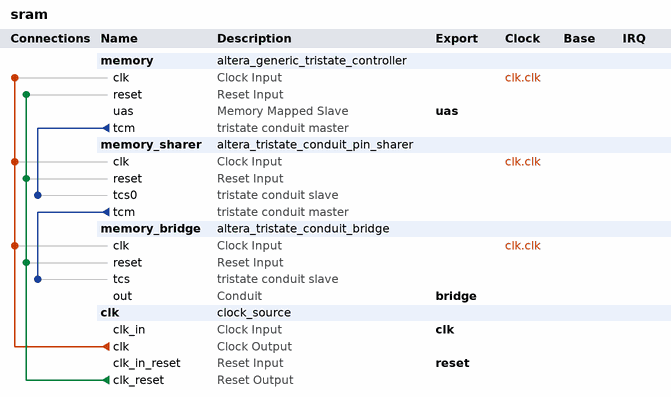
[diagram p0: system contents]
# Platform Designer (Qsys) system sram, Cyclone V 5CGXFC5C6F27C7
# Parameters at their usual value, and those the tool derives, are not listed.
package require -exact qsys 15.1
create_system sram
set_project_property DEVICE_FAMILY {Cyclone V}
set_project_property DEVICE 5CGXFC5C6F27C7

add_instance memory altera_generic_tristate_controller 15.1
set_instance_parameter_value memory ACTIVE_LOW_BEGINTRANSFER 0
set_instance_parameter_value memory ACTIVE_LOW_BYTEENABLE 1
set_instance_parameter_value memory ACTIVE_LOW_OUTPUTENABLE 1
set_instance_parameter_value memory ACTIVE_LOW_READ 0
set_instance_parameter_value memory CHIPSELECT_THROUGH_READLATENCY 0
set_instance_parameter_value memory INTERFACE_ASSIGNMENT_KEYS embeddedsw.configuration.isMemoryDevice
set_instance_parameter_value memory INTERFACE_ASSIGNMENT_VALUES 1
set_instance_parameter_value memory MODULE_ASSIGNMENT_KEYS embeddedsw.configuration.hwClassnameDriverSupportList,embeddedsw.CMacro.SRAM_MEMORY_SIZE,embeddedsw.CMacro.SRAM_MEMORY_UNITS,embeddedsw.CMacro.SSRAM_DATA_WIDTH,embeddedsw.memoryInfo.MEM_INIT_DATA_WIDTH,embeddedsw.memoryInfo.HAS_BYTE_LANE,embeddedsw.memoryInfo.GENERATE_DAT_SYM,embeddedsw.memoryInfo.DAT_SYM_INSTALL_DIR
set_instance_parameter_value memory MODULE_ASSIGNMENT_VALUES altera_avalon_lan91c111:altera_avalon_cfi_flash,524288,1,16,16,1,1,SIM_DIR
set_instance_parameter_value memory TCM_ADDRESS_W 19
set_instance_parameter_value memory TCM_BYTEENABLE_W 2
set_instance_parameter_value memory TCM_DATA_HOLD 10
set_instance_parameter_value memory TCM_DATA_W 16
set_instance_parameter_value memory TCM_MAX_PENDING_READ_TRANSACTIONS 3
set_instance_parameter_value memory TCM_READLATENCY 2
set_instance_parameter_value memory TCM_READ_WAIT 10
set_instance_parameter_value memory TCM_SETUP_WAIT 10
set_instance_parameter_value memory TCM_SYMBOLS_PER_WORD 2
set_instance_parameter_value memory TCM_TIMING_UNITS 0
set_instance_parameter_value memory TCM_TURNAROUND_TIME 2
set_instance_parameter_value memory TCM_WRITE_WAIT 10
set_instance_parameter_value memory USE_BEGINTRANSFER 0
set_instance_parameter_value memory USE_BYTEENABLE 1
set_instance_parameter_value memory USE_OUTPUTENABLE 1
set_instance_parameter_value memory USE_READ 0

add_instance memory_sharer altera_tristate_conduit_pin_sharer 15.1
set_instance_parameter_value memory_sharer MODULE_ORIGIN_LIST memory.tcm,memory.tcm,memory.tcm,memory.tcm,memory.tcm,memory.tcm
set_instance_parameter_value memory_sharer NUM_INTERFACES 1
set_instance_parameter_value memory_sharer SHARED_SIGNAL_LIST ,,
set_instance_parameter_value memory_sharer SIGNAL_ORIGIN_LIST address,byteenable_n,outputenable_n,write_n,data,chipselect_n

add_instance memory_bridge altera_tristate_conduit_bridge 15.1

add_instance clk clock_source 15.1
set_instance_parameter_value clk clockFrequency 125000000

# connections
add_connection clk.clk memory.clk clock
add_connection clk.clk memory_bridge.clk clock
add_connection clk.clk memory_sharer.clk clock
add_connection clk.clk_reset memory.reset reset
add_connection clk.clk_reset memory_bridge.reset reset
add_connection clk.clk_reset memory_sharer.reset reset
add_connection memory.tcm memory_sharer.tcs0 tristate_conduit
add_connection memory_sharer.tcm memory_bridge.tcs tristate_conduit

# exported interfaces
add_interface bridge conduit end
set_interface_property bridge EXPORT_OF memory_bridge.out
add_interface clk clock sink
set_interface_property clk EXPORT_OF clk.clk_in
add_interface reset reset sink
set_interface_property reset EXPORT_OF clk.clk_in_reset
add_interface uas avalon slave
set_interface_property uas EXPORT_OF memory.uas

set_interconnect_requirement {$system} qsys_mm.clockCrossingAdapter HANDSHAKE
set_interconnect_requirement {$system} qsys_mm.enableEccProtection FALSE
set_interconnect_requirement {$system} qsys_mm.insertDefaultSlave FALSE
set_interconnect_requirement {$system} qsys_mm.maxAdditionalLatency 1

save_system sram.qsys
